# Altium project CAN多机通信-主机.PrjPCB
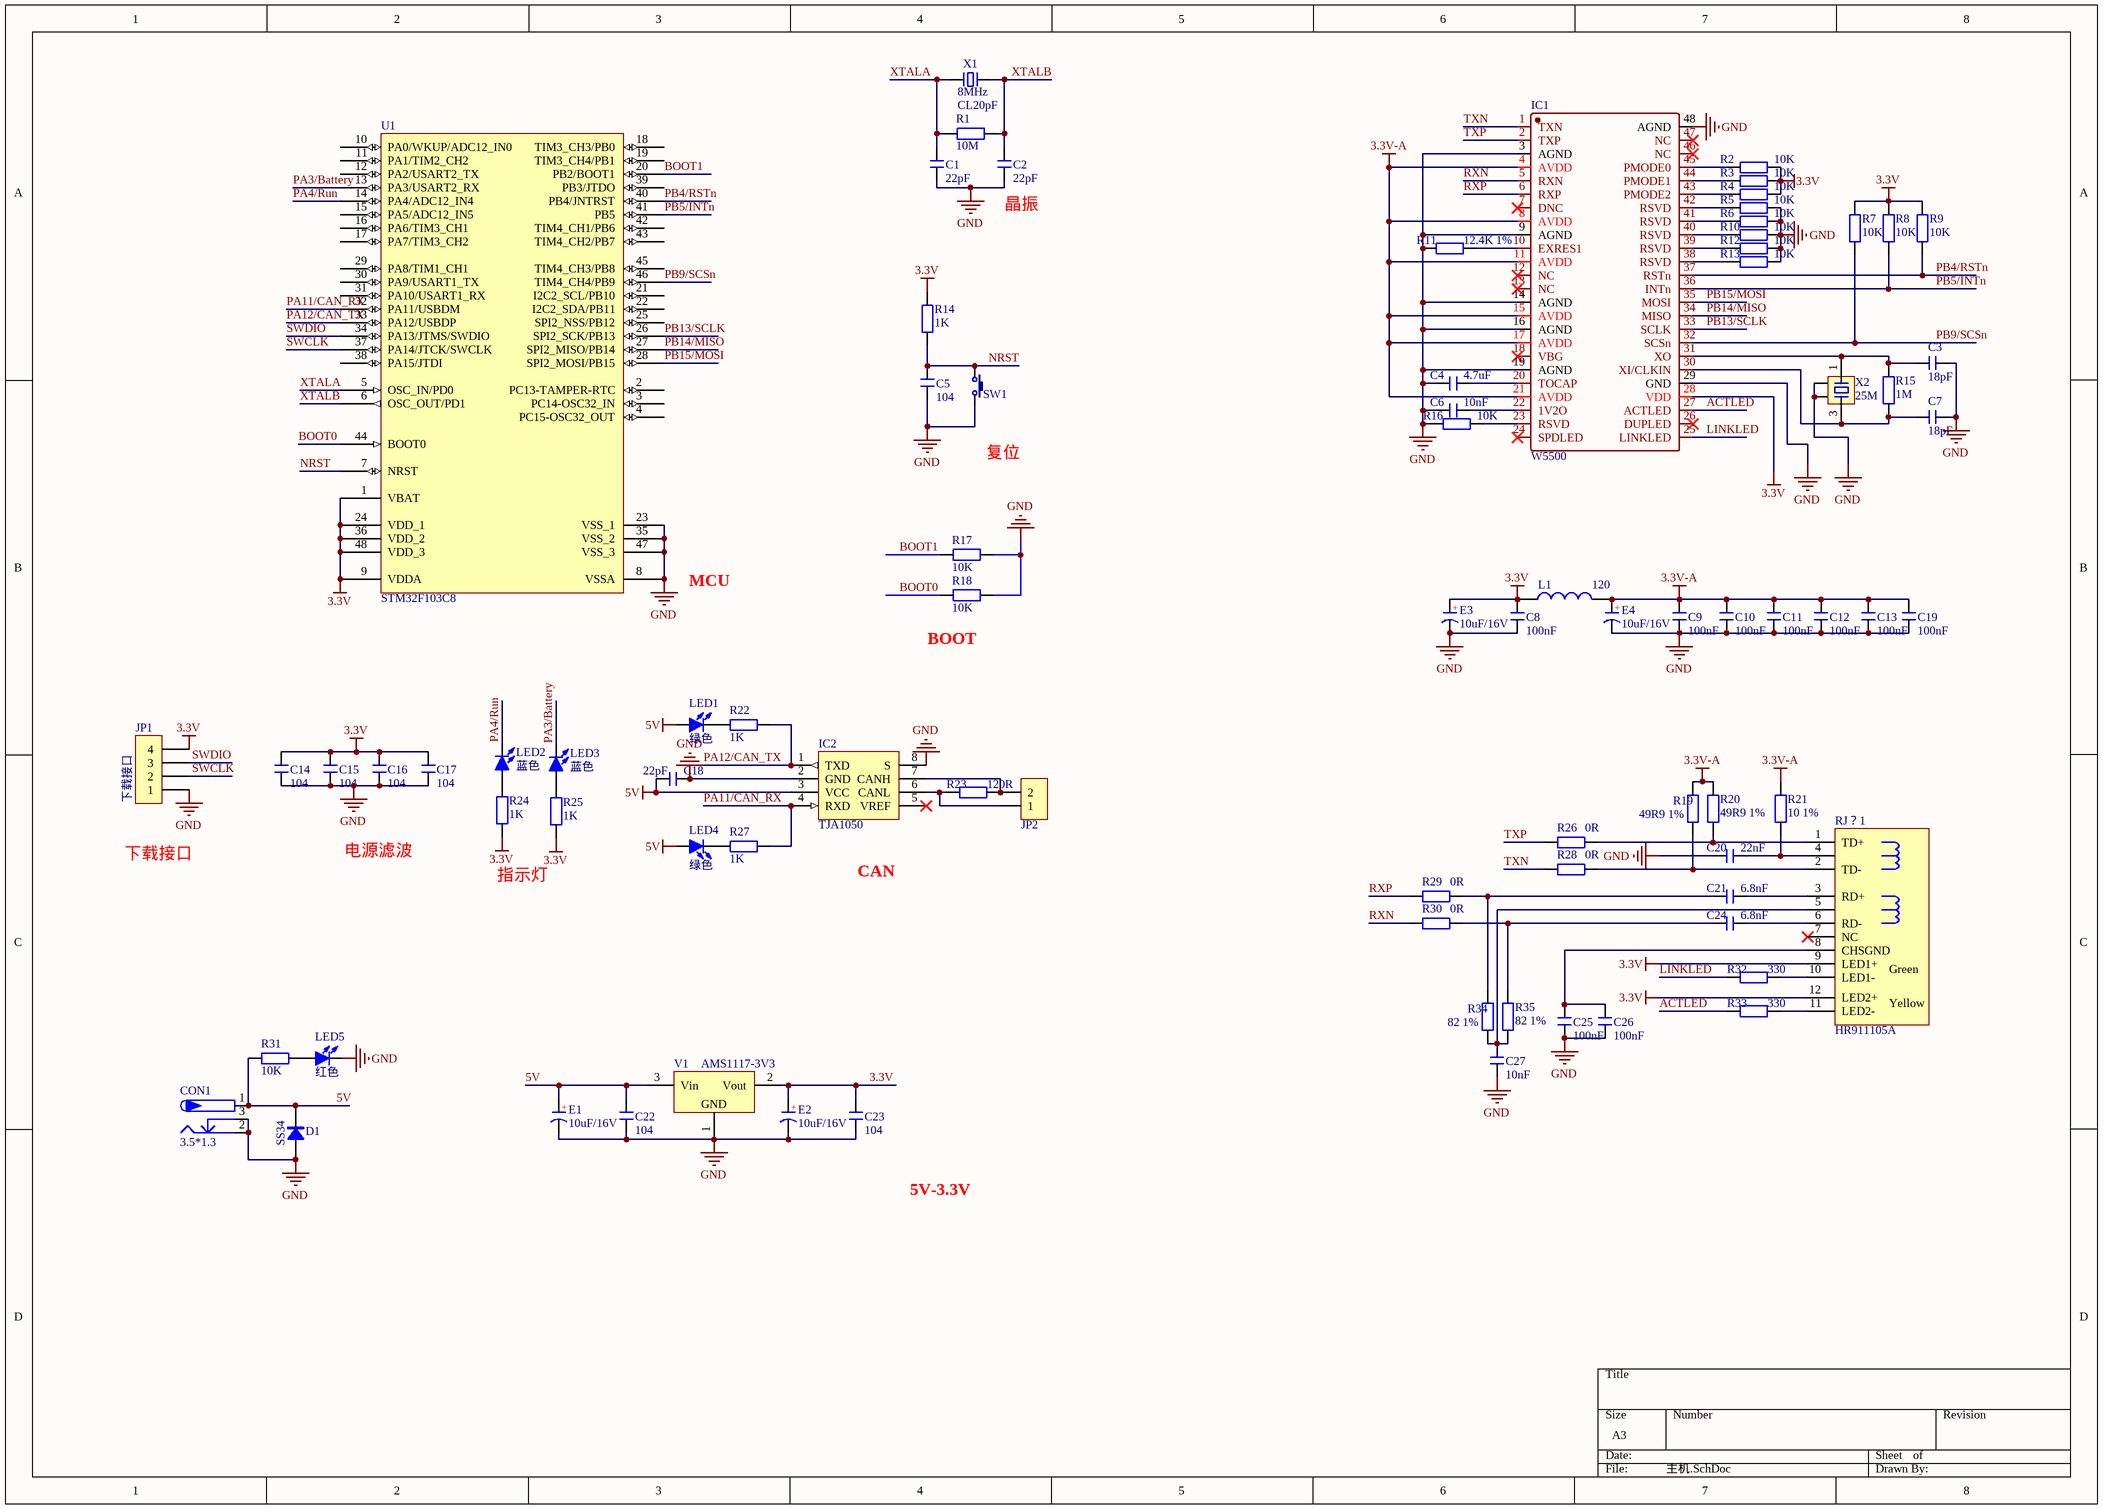
[diagram p0: 主机.SchDoc]
1 sheet, 84 parts. Net scope: global (net labels, ports and power ports of the same name join across sheets).
Board file: 主机.PcbDoc

## Sheet 主机.SchDoc
size A3

### Parts
C1  22pF  [C 0402_L]
C2  22pF  [C 0402_L]
C3  18pF  [C 0402_L]
C4  4.7uF  [C 0402_L]
C5  104  [C 0603_L]
C6  10nF  [C 0402_L]
C7  18pF  [C 0402_L]
C8  100nF  [C 0402_L]
C9  100nF  [C 0402_L]
C10  100nF  [C 0402_L]
C11  100nF  [C 0402_L]
C12  100nF  [C 0402_L]
C13  100nF  [C 0402_L]
C14  104  [C 0402_L]
C15  104  [C 0402_L]
C16  104  [C 0402_L]
C17  104  [C 0402_L]
C18  22pF  [C 0402_L]
C19  100nF  [C 0402_L]
C20  22nF  [C 0402_L]
C21  6.8nF  [C 0402_L]
C22  104  [C 0402_L]
C23  104  [C 0402_L]
C24  6.8nF  [C 0402_L]
C25  100nF  [C 0402_L]
C26  100nF  [C 0402_L]
C27  10nF  [C 0402_L]
CON1  3.5*1.3  [DC-005]
D1  SS34  [SMA]
E1  10uF/16V  [CD A(3216)]
E2  10uF/16V  [CD A(3216)]
E3  10uF/16V  [CD A(3216)]
E4  10uF/16V  [CD A(3216)]
IC1  W5500  [LQFP48-7*7]
IC2  TJA1050  [SOP8_L]
JP1  下载接口  [下载接口]
JP2  HDR-1X2  [KF350-2P]  (value not drawn)
L1  120  [L 0402]
LED1  绿色  [LED 0603G]
LED2  蓝色  [LED 0603B]
LED3  蓝色  [LED 0603B]
LED4  绿色  [LED 0603G]
LED5  红色  [LED 0603R]
R1  10M  [R 0402_L]
R2  10K  [R 0402_L]
R3  10K  [R 0402_L]
R4  10K  [R 0402_L]
R5  10K  [R 0402_L]
R6  10K  [R 0402_L]
R7  10K  [R 0402_L]
R8  10K  [R 0402_L]
R9  10K  [R 0402_L]
R10  10K  [R 0402_L]
R11  12.4K 1%  [R 0402_L]
R12  10K  [R 0402_L]
R13  10K  [R 0402_L]
R14  1K  [R 0402_L]
R15  1M  [R 0402_L]
R16  10K  [R 0402_L]
R17  10K  [R 0603_L]
R18  10K  [R 0603_L]
R19  49R9 1%  [R 0402_L]
R20  49R9 1%  [R 0402_L]
R21  10 1%  [R 0402_L]
R22  1K  [R 0402_L]
R23  120R  [R 0402_L]
R24  1K  [R 0402_L]
R25  1K  [R 0402_L]
R26  0R  [R 0402_L]
R27  1K  [R 0402_L]
R28  0R  [R 0402_L]
R29  0R  [R 0402_L]
R30  0R  [R 0402_L]
R31  10K  [R 0402_L]
R32  330  [R 0402_L]
R33  330  [R 0402_L]
R34  82 1%  [R 0402_L]
R35  82 1%  [R 0402_L]
RJ？1  HR911105A  [RJ-45A12]
SW1  3x6x5  [TSW SMD-3*6*2.5]  (value not drawn)
U1  STM32F103C8  [LQFP48 7X7_L]
V1  AMS1117-3V3  [SOT223_L]
X1  8MHz  负载电容: CL20pF  [OSC 5032-2P]
X2  25M  [OSC 3225-4P]

### Nets
3.3V: C8.2 C14.2 C15.2 C16.2 C17.2 C23.2 E2.1(A) E3.1(A) IC1.28(VDD) JP1.4 L1.1 R2.2 R3.2 R4.2 R7.2 R8.2 R9.2 R14.2 R24.2 R25.2 RJ？1.9(LED1+) RJ？1.12(LED2+) U1.1(VBAT) U1.9(VDDA) U1.24(VDD_1) U1.36(VDD_2) U1.48(VDD_3) V1.2(Vout)
3.3V-A: C9.1 C10.1 C11.1 C12.1 C13.1 C19.1 E4.1(A) IC1.4(AVDD) IC1.8(AVDD) IC1.11(AVDD) IC1.15(AVDD) IC1.17(AVDD) IC1.21(AVDD) L1.2 R19.2 R20.2 R21.2
5V: C18.2 C22.2 CON1.1 D1.2(K) E1.1(A) IC2.3(VCC) LED1.1(A) LED4.1(A) R31.1 V1.3(Vin)
GND: C1.1 C2.1 C3.1 C4.2 C5.1 C6.2 C7.1 C8.1 C9.2 C10.2 C11.2 C12.2 C13.2 C14.1 C15.1 C16.1 C17.1 C18.1 C19.2 C20.2 C22.1 C23.1 C25.1 C26.1 C27.2 CON1.2 CON1.3 D1.1(A) E1.2(K) E2.2(K) E3.2(K) E4.2(K) IC1.3(AGND) IC1.9(AGND) IC1.14(AGND) IC1.16(AGND) IC1.19(AGND) IC1.29(GND) IC1.48(AGND) IC2.2(GND) IC2.8(S) JP1.1 LED5.2(K) R5.2 R6.2 R10.2 R11.1 R12.2 R13.2 R16.1 R17.2 R18.2 SW1.2 U1.8(VSSA) U1.23(VSS_1) U1.35(VSS_2) U1.47(VSS_3) V1.1(GND) X2.2 X2.4
ACTLED: IC1.27(ACTLED) R33.2
BOOT0: R18.1 U1.44(BOOT0)
BOOT1: R17.1 U1.20(PB2/BOOT1)
LINKLED: IC1.25(LINKLED) R32.2
NRST: C5.2 R14.1 SW1.1 U1.7(NRST)
PA3/Battery: LED3.2(K) U1.13(PA3/USART2_RX)
PA4/Run: LED2.2(K) U1.14(PA4/ADC12_IN4)
PA11/CAN_RX: IC2.4(RXD) R27.1 U1.32(PA11/USBDM)
PA12/CAN_TX: IC2.1(TXD) R22.1 U1.33(PA12/USBDP)
PB4/RSTn: IC1.37(RSTn) R9.1 U1.40(PB4/JNTRST)
PB5/INTn: IC1.36(INTn) R8.1 U1.41(PB5)
PB9/SCSn: IC1.32(SCSn) R7.1 U1.46(TIM4_CH4/PB9)
PB13/SCLK: IC1.33(SCLK) U1.26(SPI2_SCK/PB13)
PB14/MISO: IC1.34(MISO) U1.27(SPI2_MISO/PB14)
PB15/MOSI: IC1.35(MOSI) U1.28(SPI2_MOSI/PB15)
RXN: IC1.5(RXN) R30.2
RXP: IC1.6(RXP) R29.2
SWCLK: JP1.2 U1.37(PA14/JTCK/SWCLK)
SWDIO: JP1.3 U1.34(PA13/JTMS/SWDIO)
TXN: IC1.1(TXN) R28.2
TXP: IC1.2(TXP) R26.2
XTALA: C1.2 R1.1 U1.5(OSC_IN/PD0) X1.1
XTALB: C2.2 R1.2 U1.6(OSC_OUT/PD1) X1.2
NetC3_2: C3.2 IC1.31(XO) R15.2 X2.1
NetC4_1: C4.1 IC1.20(TOCAP)
NetC6_1: C6.1 IC1.22(1V2O)
NetC7_2: C7.2 IC1.30(XI/CLKIN) R15.1 X2.3
NetC20_1: C20.1 R21.1 RJ？1.4
NetC21_1: C21.1 RJ？1.3(RD+)
NetC21_2: C21.2 R29.1 R34.2
NetC24_1: C24.1 RJ？1.6(RD-)
NetC24_2: C24.2 R30.1 R35.1
NetC25_2: C25.2 C26.2 RJ？1.8(CHSGND)
NetC27_1: C27.1 R34.1 R35.2 RJ？1.5
NetIC1_10: IC1.10(EXRES1) R11.2
NetIC1_23: IC1.23(RSVD) R16.2
NetIC1_38: IC1.38(RSVD) R13.1
NetIC1_39: IC1.39(RSVD) R12.1
NetIC1_40: IC1.40(RSVD) R10.1
NetIC1_41: IC1.41(RSVD) R6.1
NetIC1_42: IC1.42(RSVD) R5.1
NetIC1_43: IC1.43(PMODE2) R4.1
NetIC1_44: IC1.44(PMODE1) R3.1
NetIC1_45: IC1.45(PMODE0) R2.1
NetIC2_6: IC2.6(CANL) JP2.1 R23.2
NetIC2_7: IC2.7(CANH) JP2.2 R23.1
NetLED1_2: LED1.2(K) R22.2
NetLED2_1: LED2.1(A) R24.1
NetLED3_1: LED3.1(A) R25.1
NetLED4_2: LED4.2(K) R27.2
NetLED5_1: LED5.1(A) R31.2
NetR19_1: R19.1 R28.1 RJ？1.2(TD-)
NetR20_1: R20.1 R26.1 RJ？1.1(TD+)
NetR32_1: R32.1 RJ？1.10(LED1-)
NetR33_1: R33.1 RJ？1.11(LED2-)

Not connected (* = marked no-connect by the designer): IC1 7(DNC)* 12(NC)* 13(NC)* 18(VBG)* 24(SPDLED)* 26(DUPLED)* 46(NC)* 47(NC)*; IC2 5(VREF)*; RJ？1 7(NC)*; U1 2(PC13-TAMPER-RTC) 3(PC14-OSC32_IN) 4(PC15-OSC32_OUT) 10(PA0/WKUP/ADC12_IN0) 11(PA1/TIM2_CH2) 12(PA2/USART2_TX) 15(PA5/ADC12_IN5) 16(PA6/TIM3_CH1) 17(PA7/TIM3_CH2) 18(TIM3_CH3/PB0) 19(TIM3_CH4/PB1) 21(I2C2_SCL/PB10) 22(I2C2_SDA/PB11) 25(SPI2_NSS/PB12) 29(PA8/TIM1_CH1) 30(PA9/USART1_TX) 31(PA10/USART1_RX) 38(PA15/JTDI) 39(PB3/JTDO) 42(TIM4_CH1/PB6) 43(TIM4_CH2/PB7) 45(TIM4_CH3/PB8)

### Notes on the sheet
- (near C2) 晶振
- 复位
- MCU
- (near R18) BOOT
- 电源滤波
- 下载接口
- 指示灯
- CAN
- 5V-3.3V
- (in symbol CT) +
- (in symbol HR911105A) Green; Yellow

### Library data of the parts
C1-C27 = C: 贴片电容; BOM名称: 无极性贴片电容; 淘宝ID: 封装库来自淘宝 ID：黄晶宝石; 联系售后，技术支持: https://shop463601444.taobao.com; 唯一出售店铺网址: https://shop463601444.taobao.com
CON1 = P-DC: 低压电源接口; BOM名称: DC电源接口; 版权归属: 源创客; 学习资源: www.ooocke.com
D1 = SS54: 肖特基二极管; 版权归属: 源创客; 属性: 40V/3A; BOM名称: 肖特基二极管; 学习资源: www.ooocke.com
E1-E4 = CT: 贴片钽电容; 淘宝ID: 封装库来自淘宝 ID：黄晶宝石; BOM名称: 贴片钽电容; 联系售后: https://shop463601444.taobao.com
IC1 = W5500: 网口芯片
IC2 = TJA1050: CAN总线收发芯片; 版权归属: 封装库来自淘宝 ID：黄晶宝石; BOM名称: CAN总线收发芯片; 学习资源: https://shop463601444.taobao.com
JP1 = 下载接口: Jlink下载接口
JP2 = Header 2: 2P接插件; 版权归属: 封装库来自淘宝卖家 ID：黄晶宝石; BOM名称: 2P接插件; 技术支持，联系售后: https://shop463601444.taobao.com
L1 = L: 小功率贴片电感; 淘宝ID: 封装库来自淘宝 ID：黄晶宝石; 封装库来自淘宝卖家 ID：黄晶宝石: 其他店铺购入均为盗版，不享受售后技术支持服务，请立即申请退款; BOM名称: 小功率贴片电感; 联系售后: https://shop463601444.taobao.com
LED1-LED5 = LED-SMD: 贴片LED; 版权归属: 封装库来自淘宝 ID：黄晶宝石; BOM名称: 贴片LED; 学习资源: https://shop463601444.taobao.com
R1-R35 = R: 贴片电阻; 版权归属: 来自淘宝 ID：黄晶宝石; 封装库来自淘宝卖家 ID：黄晶宝石: 其他店铺购入均为盗版，不享受售后技术支持服务，请立即申请退款; BOM名称: 贴片电阻; 联系售后: https://shop463601444.taobao.com
RJ？1 = HR911105A: 带灯以太网接口; 版权归属: 封装库来自淘宝 ID：黄晶宝石; BOM名称: 带灯以太网接口; 学习资源: https://shop463601444.taobao.com
SW1 = TSW 3x6: 3x6轻触开关; 版权归属: 源创客; BOM名称: 3x6轻触开关; 学习资源: www.ooocke.com
U1 = STM32F103C8: Flaah:64/RAM:20/IO:36; BOM名称: 32位STM单片机; 版权归属: 源创客; 学习资源: www.ooocke.com
V1 = AMS1117: 三端稳压芯片; BOM名称: 稳压芯片; 淘宝ID: 封装库来自淘宝 ID：黄晶宝石; 欢迎光临淘宝店铺: https://shop463601444.taobao.com
X1 = XTAL-2P: 2脚无源脚晶振; 版权归属: 源创客; BOM名称: 2脚无源脚晶振; 学习资源: www.ooocke.com
X2 = XTAL-4P: 4脚无源晶振; 版权归属: 封装库来自淘宝卖家 ID：黄晶宝石; BOM名称: 4脚无源晶振; 学习资源: https://shop463601444.taobao.com